# EAGLE design rev-b (EAGLE 8.3.1)
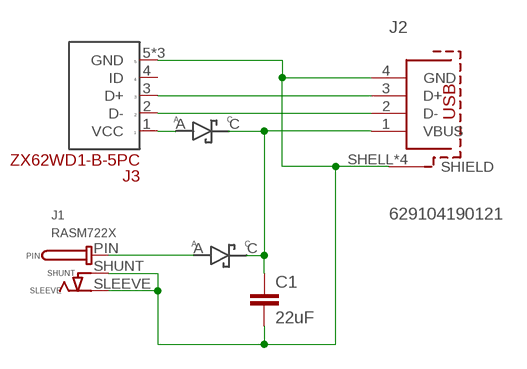
[diagram p0: schematic, sheet 1]

## Parts
C1  22uF  2.2UF-1206-50V-10%  [1206]
D1  PMEG6030ETP  [SOD128]
D2  PMEG6030ETP  [SOD128]
J1  RASM722X  [SWITCHCRAFT_RASM722X]
J2  629104190121  [629104190121]
J3  ZX62WD1-B-5PC  [ZX62WD1-B-5PC]

## Nets
N$1: J2.3(D+) J3.3(D+)
N$2: J2.2(D-) J3.2(D-)
N$3: C1.1 D1.C D2.C J2.1(VBUS)
N$4: D2.A J3.1(VCC)
N$6: D1.A J1.PIN
N$7: C1.2 J1.SHUNT J1.SLEEVE J2.4(GND) J2.SHELL1(SHIELD) J2.SHELL2(SHIELD) J2.SHELL3(SHIELD) J2.SHELL(SHIELD) J3.5(GND) J3.P$1(GND) J3.P$2(GND)
Unconnected: J3.4(ID)

## Library data of the parts
C1 = SparkFun-Capacitors:2.2UF: 2.2µF ceramic capacitors A capacitor is a passive two-terminal electrical component used to store electrical energy temporarily in an electric field.; PROD_ID: CAP-10009; VALUE: 2.2uF
D1 D2 = schottky-barrier-rectifier:PMEG6030ETP
J1 = RASM722X:RASM722X: Connector; Miniature Power Jack; 0.57 in.; 0.08; Surface Mount; AVAILABILITY: Good; DESCRIPTION: DC%2C Right Angle DC Power Plug Rated At 5A%2C SMT Mount%2C Nickel Plate; MF: Switchcraft; MP: RASM722X; PACKAGE: None; PRICE: 1.03 USD
J2 = wurth-USB_A-629104190121:629104190121: USB 2.0 Type A Horizontal SMT Short Type WR-COM_629104190121 <http://katalog.we-online.de/media/images/v2/Family_WR-COM_629104190121.jpg> Details see: http://katalog.we-online.de/en/em/COM_2_0_SMT_TYPE_A_HORIZONTAL_SHORT_TYPE/629104190121 Created bY Yingchun,Shan 2016 (C) Würth Elektronik; AVAILABILITY: Warning; DESCRIPTION: Wr-Com Usb Type a Horizontal Smt; MF: Würth Elektronik; MP: 629104190121; PACKAGE: None; PRICE: 1.18 USD
J3 = micro-usb-b:ZX62WD1-B-5PC

## Board
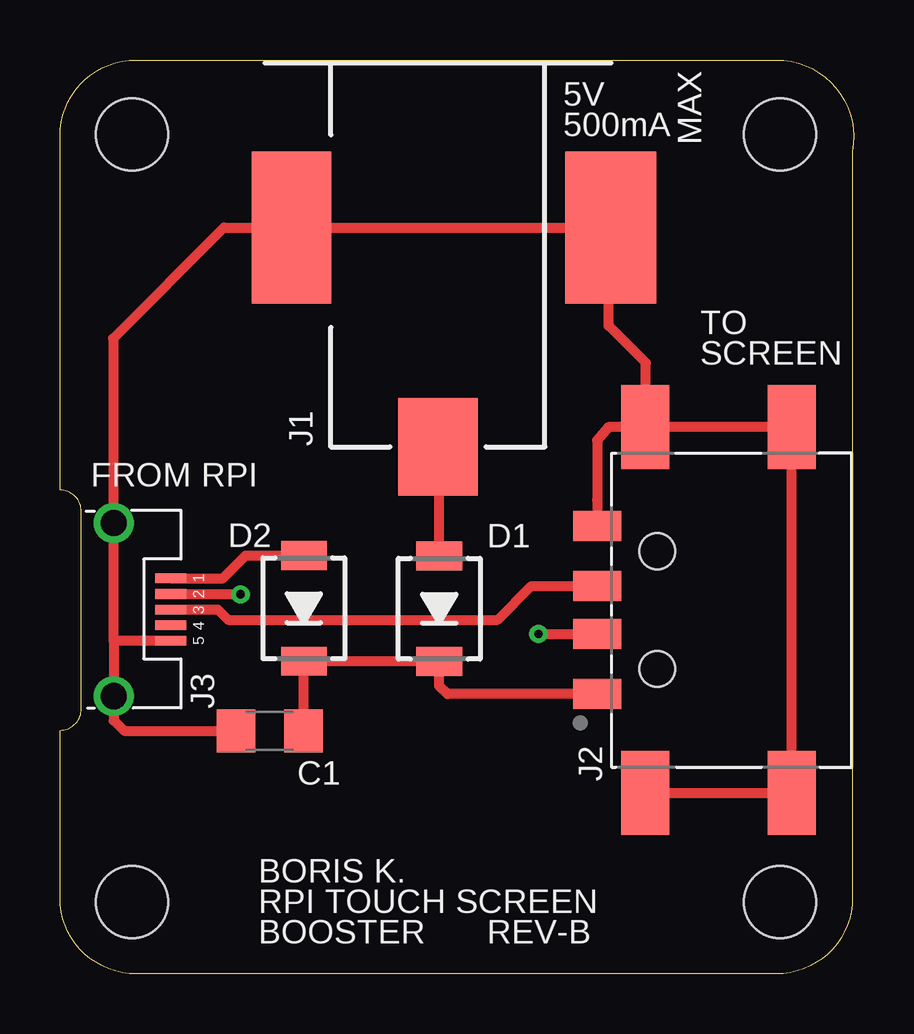
[diagram p1: board, top side]
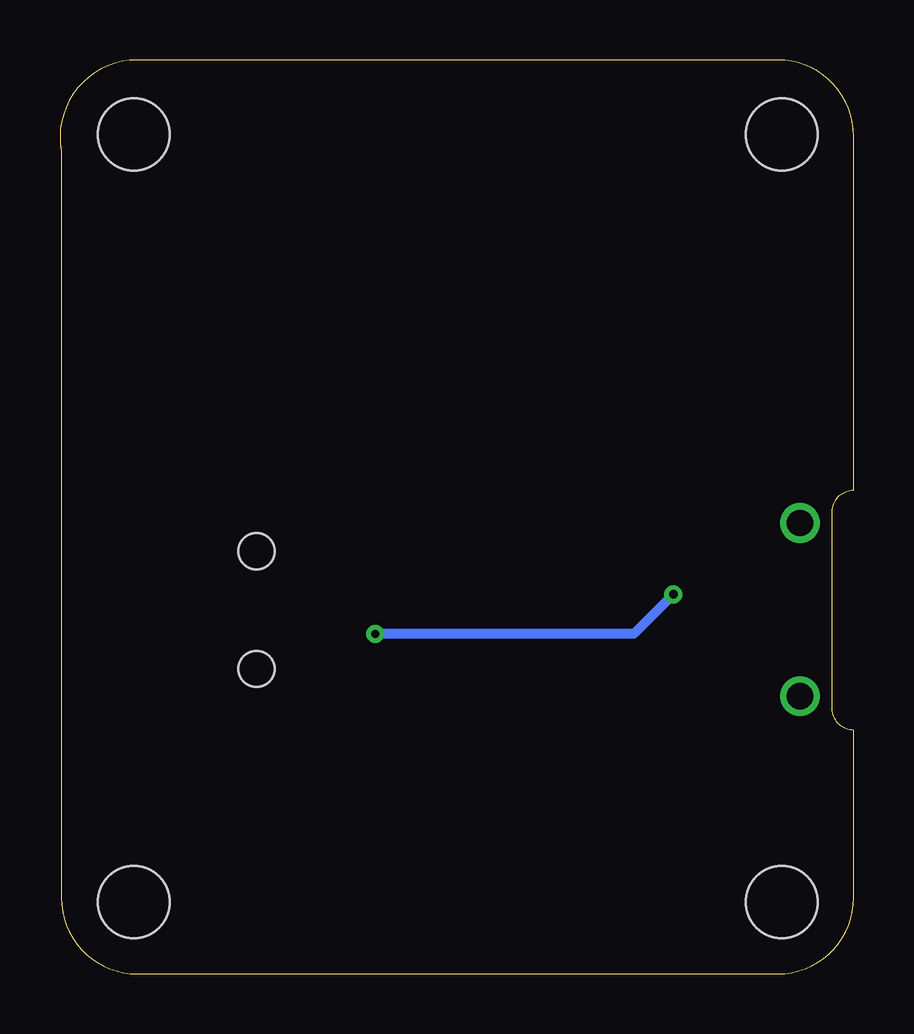
[diagram p2: board, bottom side, seen from below]

Size 33.07 x 38.1 mm. Coordinates in mm from the lower left corner, seen from the top.
Outline: 3.17,0 arc-90 0,3.17 0,10.16 arc90 0.89,11.05 0.89,19.28 arc90 0,20.17 0,34.92 arc-90 3.17,38.1 29.84,38.1 arc-100 33.02,34.29 33.02,3.17 arc-90 29.84,0 3.17,0
Copper layers (1*16): Top 0.035mm / dielectric 1.5mm / Bottom 0.035mm
Design rules "default *": minimum track width 6mil, minimum drill 0.35mm, track to track 6mil, track to pad 6mil, pad to pad 6mil, via to via 6mil, smd to smd 6mil, copper to edge 40mil, drill to drill 4mil, minimum pad ring 10mil, minimum via ring 8mil, stop-mask expansion 4mil, vias tented up to drill 0mil, thermal gap 10mil
Holes 3 mm at 3,35 30,35 30,3 3,3

### Footprints (pad centres in the part's own frame; a part is rotated, then mirrored left to right if it is on the bottom)
1206 = smd 1.6 x 1.8: 1 -1.4,0; 2 1.4,0
SOD128 = smd 1.2 x 1.9: A 2.2,0; C -2.2,0
SWITCHCRAFT_RASM722X = smd 3.3 x 4.06: PIN 0,0 | smd 3.3 x 6.35: SHUNT 6.1,-9.14 | smd 3.81 x 6.35: SLEEVE -7.2,-9.14
629104190121 = smd 1.25 x 2: 1 -3.5,2; 2 -1,2; 3 1,2; 4 3.5,2 | smd 3.5 x 2: SHELL -7.625,0; SHELL1 7.625,0; SHELL2 -7.625,-6.1; SHELL3 7.625,-6.1 | hole 1.5: -2.45,-0.5; 2.45,-0.5
ZX62WD1-B-5PC = smd 0.4 x 1.3: 1 -1.3,3.73; 2 -0.65,3.73; 3 0,3.73; 4 0.65,3.73; 5 1.3,3.73 | drill 1.1 pad 1.5: P$1 3.61,1.35; P$2 -3.61,1.35

### Placement (x,y rotation side)
C1  8.74,10.13 180 top
D1  15.8,15.23 90 top
D2  10.16,15.24 90 top
J1  15.75,21.97 180 top
J2  24.38,15.16 90 top
J3  0.89,15.19 270 top

### Tracks (layer width: path | path; a pad name or v marks a point on that pad's centre or on a via)
N$1
  Top 0.406: J3.3 6.58,15.19 7.01,14.76 18.24,14.76 19.64,16.16 J2.3
N$2  (via drill 0.35)
  Top 0.406: J3.2 7.5,15.84 arc-90 v7.52,15.82 | v19.94,14.17 v19.95,14.16 J2.2
  Bottom 0.406: v7.52,15.82 9.17,14.17 v19.94,14.17
N$3
  Top 0.406: D1.C 15.8,12.9 | C1.1 10.16,10.16 D2.C 15.79,13.04 D1.C | J2.1 16.15,11.66 15.8,12.01 D1.C
N$4
  Top 0.406: J3.1 6.79,16.49 7.74,17.44 D2.A
N$6
  Top 0.406: D1.A 15.8,21.92 J1.PIN
N$7
  Top 0.406: 22.91,31.11 J1.SHUNT 6.83,31.11 2.21,26.49 2.21,18.83 J3.P$2 2.24,13.88 | 22.91,31.11 J1.SLEEVE | J2.SHELL J2.SHELL2 J2.SHELL3 J2.SHELL1 | J2.SHELL1 22.84,22.79 22.38,22.25 22.38,19.76 J2.4 | 2.24,13.88 J3.P$1 2.24,10.56 2.67,10.13 C1.2 | J3.5 2.24,13.89 2.24,13.88 | J2.SHELL1 24.41,25.48 22.86,27.03 22.86,31.06 22.91,31.11

### Text on the board
tPlace: 5V | 500mA | MAX | TO | SCREEN | FROM RPI | J3 | BORIS K. | RPI TOUCH SCREEN | BOOSTER | REV-B